# Altium schematic sheet 辉光钟第二版.SchDoc
size A3
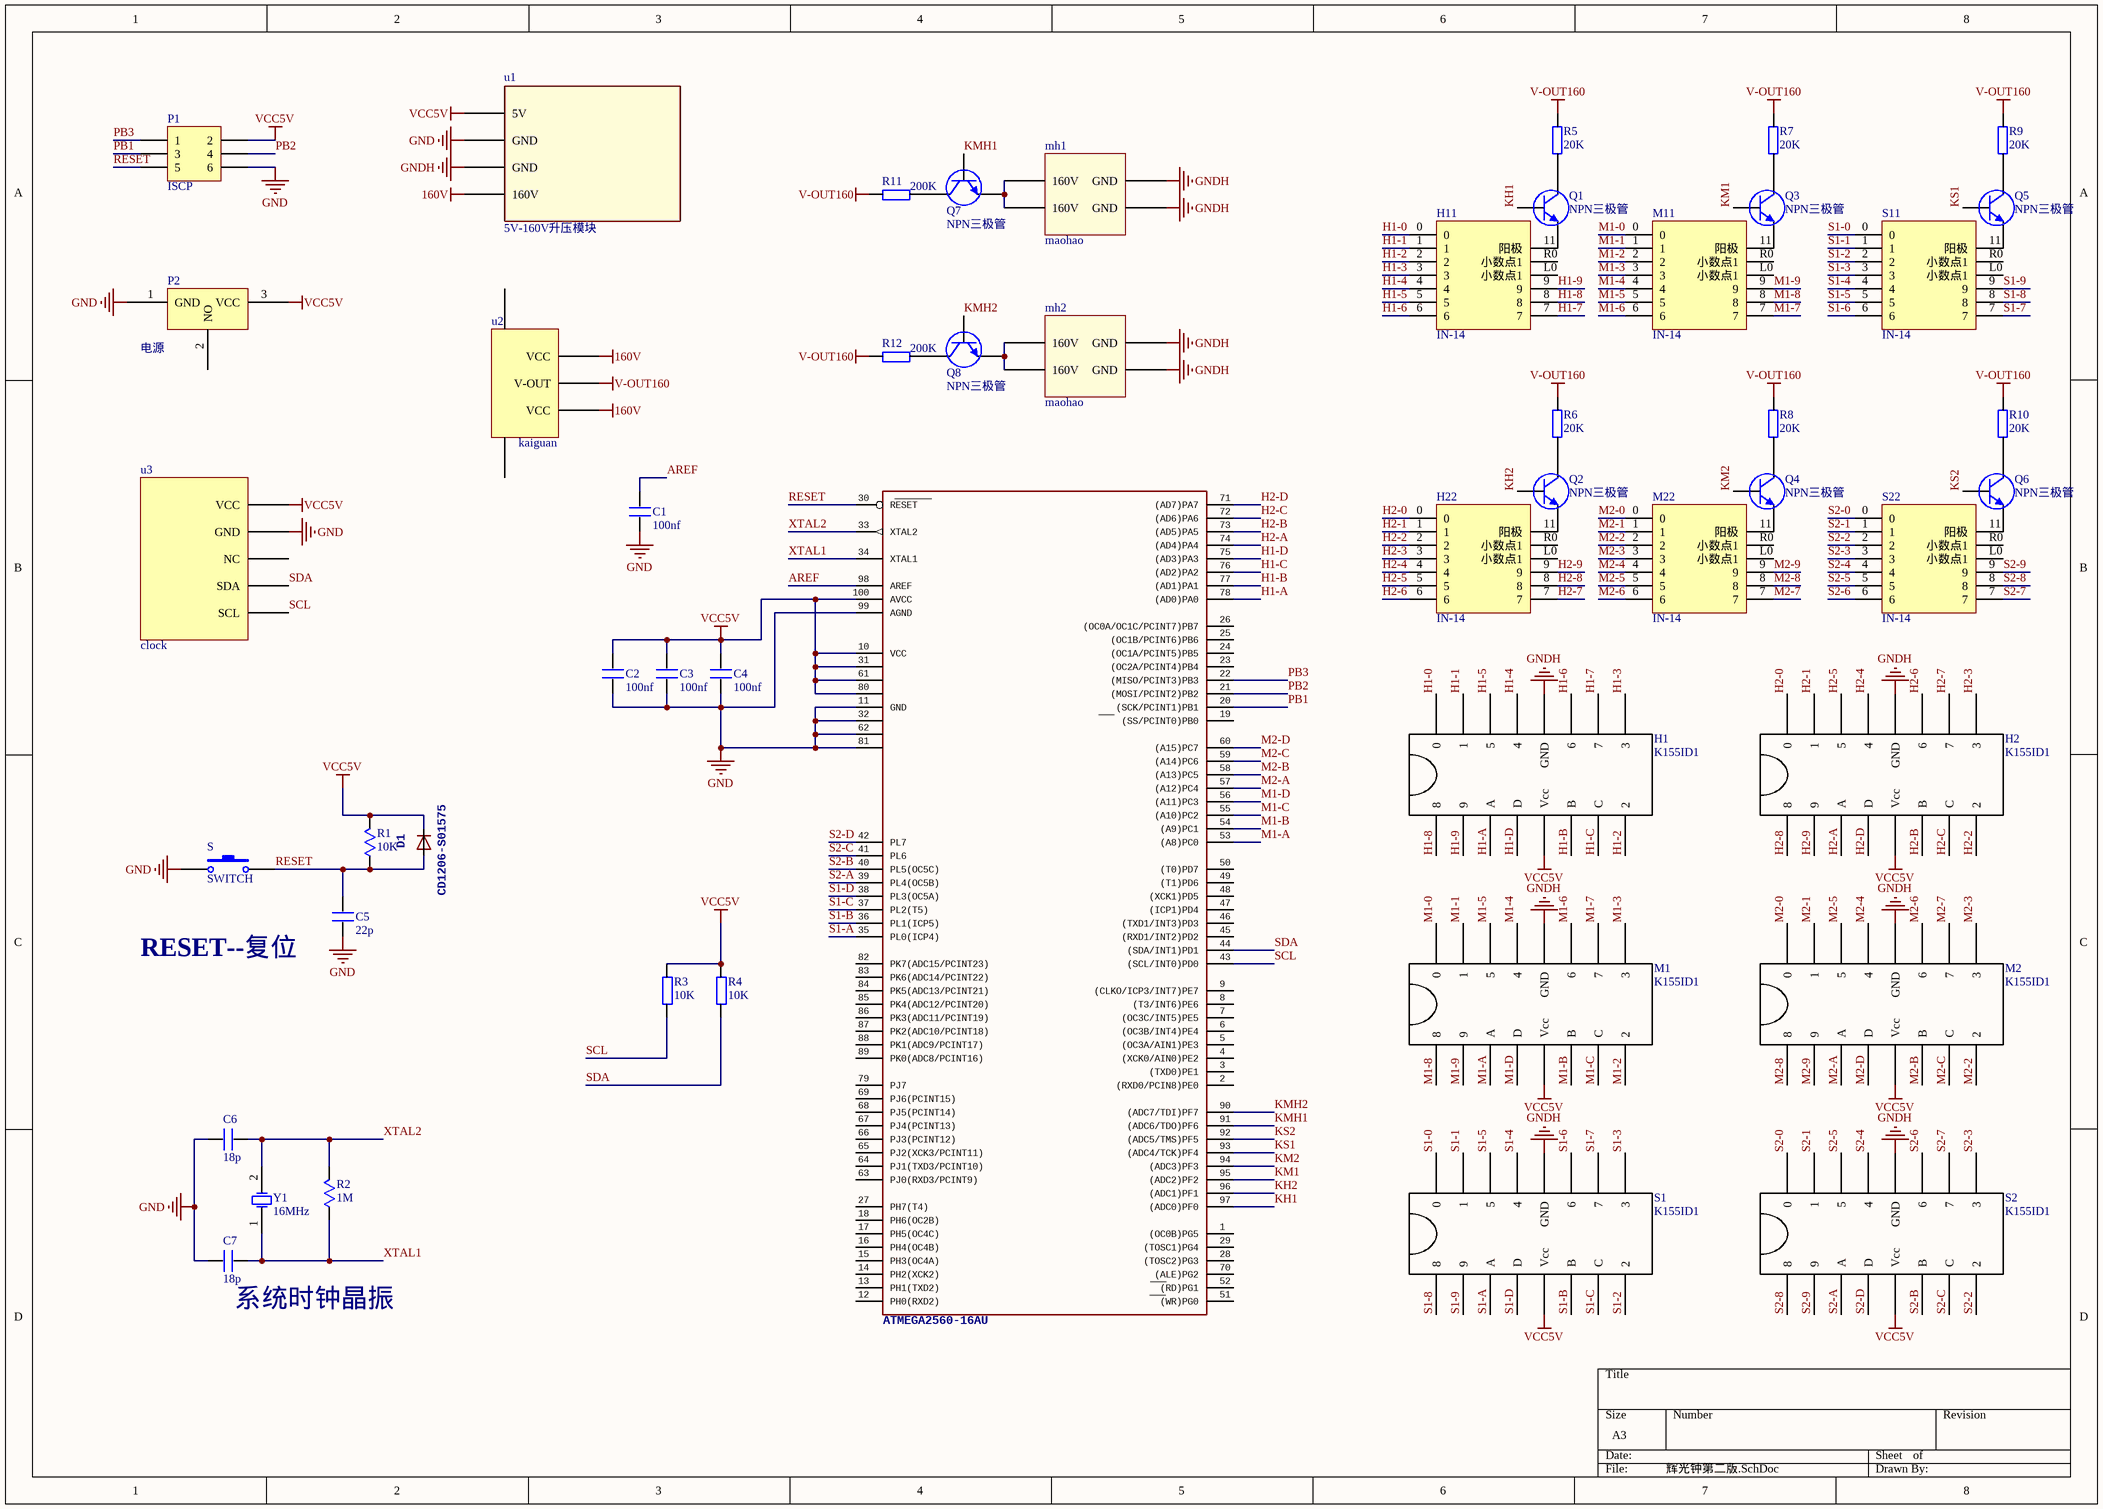
[diagram p0: 辉光钟第二版.SchDoc]

## Parts
C1  100nf  [0805]
C2  100nf  [0805]
C3  100nf  [0805]
C4  100nf  [0805]
C5  22p  [0805]
C6  18p  [0805]
C7  18p  [0805]
D1  CD1206-S01575  [MINIMELF]
H1  K155ID1  [DIP-16]
H2  K155ID1  [DIP-16]
H11  IN-14  [IN-14]
H22  IN-14  [IN-14]
M1  K155ID1  [DIP-16]
M2  K155ID1  [DIP-16]
M11  IN-14  [IN-14]
M22  IN-14  [IN-14]
mh1  maohao  [PCBComponent_1]
mh2  maohao  [PCBComponent_1]
P1  ISCP  [HDR2X3]
P2  电源  [DC5.5-2.1]
Q1  NPN三极管  [TO-92]
Q2  NPN三极管  [TO-92]
Q3  NPN三极管  [TO-92]
Q4  NPN三极管  [TO-92]
Q5  NPN三极管  [TO-92]
Q6  NPN三极管  [TO-92]
Q7  NPN三极管  [TO-92]
Q8  NPN三极管  [TO-92]
R1  10K  [0805]
R2  1M  [0805]
R3  10K  [0805]
R4  10K  [0805]
R5  20K  [0805]
R6  20K  [0805]
R7  20K  [0805]
R8  20K  [0805]
R9  20K  [0805]
R10  20K  [0805]
R11  200K  [0805]
R12  200K  [0805]
S  SWITCH  [SWITCH]
S1  K155ID1  [DIP-16]
S2  K155ID1  [DIP-16]
S11  IN-14  [IN-14]
S22  IN-14  [IN-14]
u0  ATMEGA2560-16AU  [TQFP100]
u1  5V-160V升压模块  [PCBComponent_1]
u2  kaiguan  [PCBComponent_1]
u3  clock  [PCBComponent_1]
Y1  16MHz  [XTAL_US]

## Nets
160V: u1.4(160V) u2.1(VCC) u2.3(VCC)
GND: C1.1 C2.1 C3.1 C4.1 C5.1 C6.1 C7.1 P1.6 P2.1(GND) S.1 u0.11(GND) u0.32(GND1) u0.62(GND2) u0.81(GND3) u0.99(AGND) u1.2(GND) u3.2(GND)
GNDH: H1.12(GND) H2.12(GND) M1.12(GND) M2.12(GND) mh1.2(GND) mh1.4(GND) mh2.2(GND) mh2.4(GND) S1.12(GND) S2.12(GND) u1.3(GND)
V-OUT160: R5.1 R6.1 R7.1 R8.1 R9.1 R10.1 R11.1 R12.1 u2.2(V-OUT)
VCC5V: C2.2 C3.2 C4.2 D1.C H1.5(Vcc) H2.5(Vcc) M1.5(Vcc) M2.5(Vcc) P1.2 P2.3(VCC) R1.2 R3.2 R4.2 S1.5(Vcc) S2.5(Vcc) u0.10(VCC) u0.31(VCC1) u0.61(VCC2) u0.80(VCC3) u0.100(AVCC) u1.1(5V) u3.1(VCC)
AREF: C1.2 u0.98(AREF)
H1-0: H1.16(0) H11.0
H1-1: H1.15(1) H11.1
H1-2: H1.8(2) H11.2
H1-3: H1.9(3) H11.3
H1-4: H1.13(4) H11.4
H1-5: H1.14(5) H11.5
H1-6: H1.11(6) H11.6
H1-7: H1.10(7) H11.7
H1-8: H1.1(8) H11.8
H1-9: H1.2(9) H11.9
H1-A: H1.3(A) u0.78((AD0)PA0)
H1-B: H1.6(B) u0.77((AD1)PA1)
H1-C: H1.7(C) u0.76((AD2)PA2)
H1-D: H1.4(D) u0.75((AD3)PA3)
H2-0: H2.16(0) H22.0
H2-1: H2.15(1) H22.1
H2-2: H2.8(2) H22.2
H2-3: H2.9(3) H22.3
H2-4: H2.13(4) H22.4
H2-5: H2.14(5) H22.5
H2-6: H2.11(6) H22.6
H2-7: H2.10(7) H22.7
H2-8: H2.1(8) H22.8
H2-9: H2.2(9) H22.9
H2-A: H2.3(A) u0.74((AD4)PA4)
H2-B: H2.6(B) u0.73((AD5)PA5)
H2-C: H2.7(C) u0.72((AD6)PA6)
H2-D: H2.4(D) u0.71((AD7)PA7)
KH1: Q1.2(B) u0.97((ADC0)PF0)
KH2: Q2.2(B) u0.96((ADC1)PF1)
KM1: Q3.2(B) u0.95((ADC2)PF2)
KM2: Q4.2(B) u0.94((ADC3)PF3)
KMH1: Q7.2(B) u0.91((ADC6/TDO)PF6)
KMH2: Q8.2(B) u0.90((ADC7/TDI)PF7)
KS1: Q5.2(B) u0.93((ADC4/TCK)PF4)
KS2: Q6.2(B) u0.92((ADC5/TMS)PF5)
M1-0: M1.16(0) M11.0
M1-1: M1.15(1) M11.1
M1-2: M1.8(2) M11.2
M1-3: M1.9(3) M11.3
M1-4: M1.13(4) M11.4
M1-5: M1.14(5) M11.5
M1-6: M1.11(6) M11.6
M1-7: M1.10(7) M11.7
M1-8: M1.1(8) M11.8
M1-9: M1.2(9) M11.9
M1-A: M1.3(A) u0.53((A8)PC0)
M1-B: M1.6(B) u0.54((A9)PC1)
M1-C: M1.7(C) u0.55((A10)PC2)
M1-D: M1.4(D) u0.56((A11)PC3)
M2-0: M2.16(0) M22.0
M2-1: M2.15(1) M22.1
M2-2: M2.8(2) M22.2
M2-3: M2.9(3) M22.3
M2-4: M2.13(4) M22.4
M2-5: M2.14(5) M22.5
M2-6: M2.11(6) M22.6
M2-7: M2.10(7) M22.7
M2-8: M2.1(8) M22.8
M2-9: M2.2(9) M22.9
M2-A: M2.3(A) u0.57((A12)PC4)
M2-B: M2.6(B) u0.58((A13)PC5)
M2-C: M2.7(C) u0.59((A14)PC6)
M2-D: M2.4(D) u0.60((A15)PC7)
PB1: P1.3 u0.20((SCK/PCINT1)PB1)
PB2: P1.4 u0.21((MOSI/PCINT2)PB2)
PB3: P1.1 u0.22((MISO/PCINT3)PB3)
RESET: C5.2 D1.A P1.5 R1.1 S.2 u0.30(RESET)
S1-0: S1.16(0) S11.0
S1-1: S1.15(1) S11.1
S1-2: S1.8(2) S11.2
S1-3: S1.9(3) S11.3
S1-4: S1.13(4) S11.4
S1-5: S1.14(5) S11.5
S1-6: S1.11(6) S11.6
S1-7: S1.10(7) S11.7
S1-8: S1.1(8) S11.8
S1-9: S1.2(9) S11.9
S1-A: S1.3(A) u0.35(PL0(ICP4))
S1-B: S1.6(B) u0.36(PL1(ICP5))
S1-C: S1.7(C) u0.37(PL2(T5))
S1-D: S1.4(D) u0.38(PL3(OC5A))
S2-0: S2.16(0) S22.0
S2-1: S2.15(1) S22.1
S2-2: S2.8(2) S22.2
S2-3: S2.9(3) S22.3
S2-4: S2.13(4) S22.4
S2-5: S2.14(5) S22.5
S2-6: S2.11(6) S22.6
S2-7: S2.10(7) S22.7
S2-8: S2.1(8) S22.8
S2-9: S2.2(9) S22.9
S2-A: S2.3(A) u0.39(PL4(OC5B))
S2-B: S2.6(B) u0.40(PL5(OC5C))
S2-C: S2.7(C) u0.41(PL6)
S2-D: S2.4(D) u0.42(PL7)
SCL: R3.1 u0.43((SCL/INT0)PD0) u3.5(SCL)
SDA: R4.1 u0.44((SDA/INT1)PD1) u3.4(SDA)
XTAL1: C7.2 R2.1 u0.34(XTAL1) Y1.1(OSC1)
XTAL2: C6.2 R2.2 u0.33(XTAL2) Y1.2(OSC2)
NetH11_11: H11.11(阳极) Q1.3(E)
NetH22_11: H22.11(阳极) Q2.3(E)
NetM11_11: M11.11(阳极) Q3.3(E)
NetM22_11: M22.11(阳极) Q4.3(E)
Netmh1_1: mh1.1(160V) mh1.3(160V) Q7.3(E)
Netmh2_1: mh2.1(160V) mh2.3(160V) Q8.3(E)
NetQ1_1: Q1.1(C) R5.2
NetQ2_1: Q2.1(C) R6.2
NetQ3_1: Q3.1(C) R7.2
NetQ4_1: Q4.1(C) R8.2
NetQ5_1: Q5.1(C) R9.2
NetQ5_3: Q5.3(E) S11.11(阳极)
NetQ6_1: Q6.1(C) R10.2
NetQ6_3: Q6.3(E) S22.11(阳极)
NetQ7_1: Q7.1(C) R11.2
NetQ8_1: Q8.1(C) R12.2

Not connected (* = marked no-connect by the designer): H11 L0(小数点1) R0(小数点1); H22 L0(小数点1) R0(小数点1); M11 L0(小数点1) R0(小数点1); M22 L0(小数点1) R0(小数点1); P2 2(NO); S11 L0(小数点1) R0(小数点1); S22 L0(小数点1) R0(小数点1); u0 1((OC0B)PG5) 2((RXD0/PCIN8)PE0) 3((TXD0)PE1) 4((XCK0/AIN0)PE2) 5((OC3A/AIN1)PE3) 6((OC3B/INT4)PE4) 7((OC3C/INT5)PE5) 8((T3/INT6)PE6) 9((CLKO/ICP3/INT7)PE7) 12(PH0(RXD2)) 13(PH1(TXD2)) 14(PH2(XCK2)) 15(PH3(OC4A)) 16(PH4(OC4B)) 17(PH5(OC4C)) 18(PH6(OC2B)) 19((SS/PCINT0)PB0) 23((OC2A/PCINT4)PB4) 24((OC1A/PCINT5)PB5) 25((OC1B/PCINT6)PB6) 26((OC0A/OC1C/PCINT7)PB7) 27(PH7(T4)) 28((TOSC2)PG3) 29((TOSC1)PG4) 45((RXD1/INT2)PD2) 46((TXD1/INT3)PD3) 47((ICP1)PD4) 48((XCK1)PD5) 49((T1)PD6) 50((T0)PD7) 51((WR)PG0) 52((RD)PG1) 63(PJ0(RXD3/PCINT9)) 64(PJ1(TXD3/PCINT10)) 65(PJ2(XCK3/PCINT11)) 66(PJ3(PCINT12)) 67(PJ4(PCINT13)) 68(PJ5(PCINT14)) 69(PJ6(PCINT15)) 70((ALE)PG2) 79(PJ7) 82(PK7(ADC15/PCINT23)) 83(PK6(ADC14/PCINT22)) 84(PK5(ADC13/PCINT21)) 85(PK4(ADC12/PCINT20)) 86(PK3(ADC11/PCINT19)) 87(PK2(ADC10/PCINT18)) 88(PK1(ADC9/PCINT17)) 89(PK0(ADC8/PCINT16)); u2 4 5; u3 3(NC)

## Notes on the sheet
- RESET--复位
- (near C7) 系统时钟晶振

## Library data of the parts
C1-C4 = C
C5 = C_3
C6 C7 = C_1
D1 = DIODE-MINIMELF: <b>DIODE</b>
P1 = Header 3X2: Header, 3-Pin, Dual row; LatestRevisionDate: 17-Jul-2002; LatestRevisionNote: Re-released for DXP Platform.; Publisher: Altium Limited
P2 = dc5.5-2.1
Q1-Q8 = NPN三极管_1: NPN; Published: 8-Jun-2000; LatestRevisionDate: 17-Jul-2002; LatestRevisionNote: Re-released for DXP Platform.; PackageReference: TO-226; Publisher: Altium Limited; Code_JEDEC: TO-226-AA
R1 R2 = RES
R3-R12 = R
u0 = ATMEGA2560AU: <b>MICROCONTROLLER</b><p> / 64/128/256 Kbytes FLASH<p> / 4 Kbytes EEPROM<p> / 8 Kbytes SRAM<p> / 86 General Purpose I/O pins<p> / 12-channels16-bit PWM<p> / 4 x Serial USARTs<p> / 16-channels 10-bit A/D<p>
u1 = 5-160
Y1 = XTAL: Crystal Oscillator; Published: 8-Jun-2000; LatestRevisionDate: 17-Jul-2002; LatestRevisionNote: Re-released for DXP Platform.; Publisher: Altium Limited